# EAGLE design GW-RS485-V41-001 (EAGLE 7.6.0)
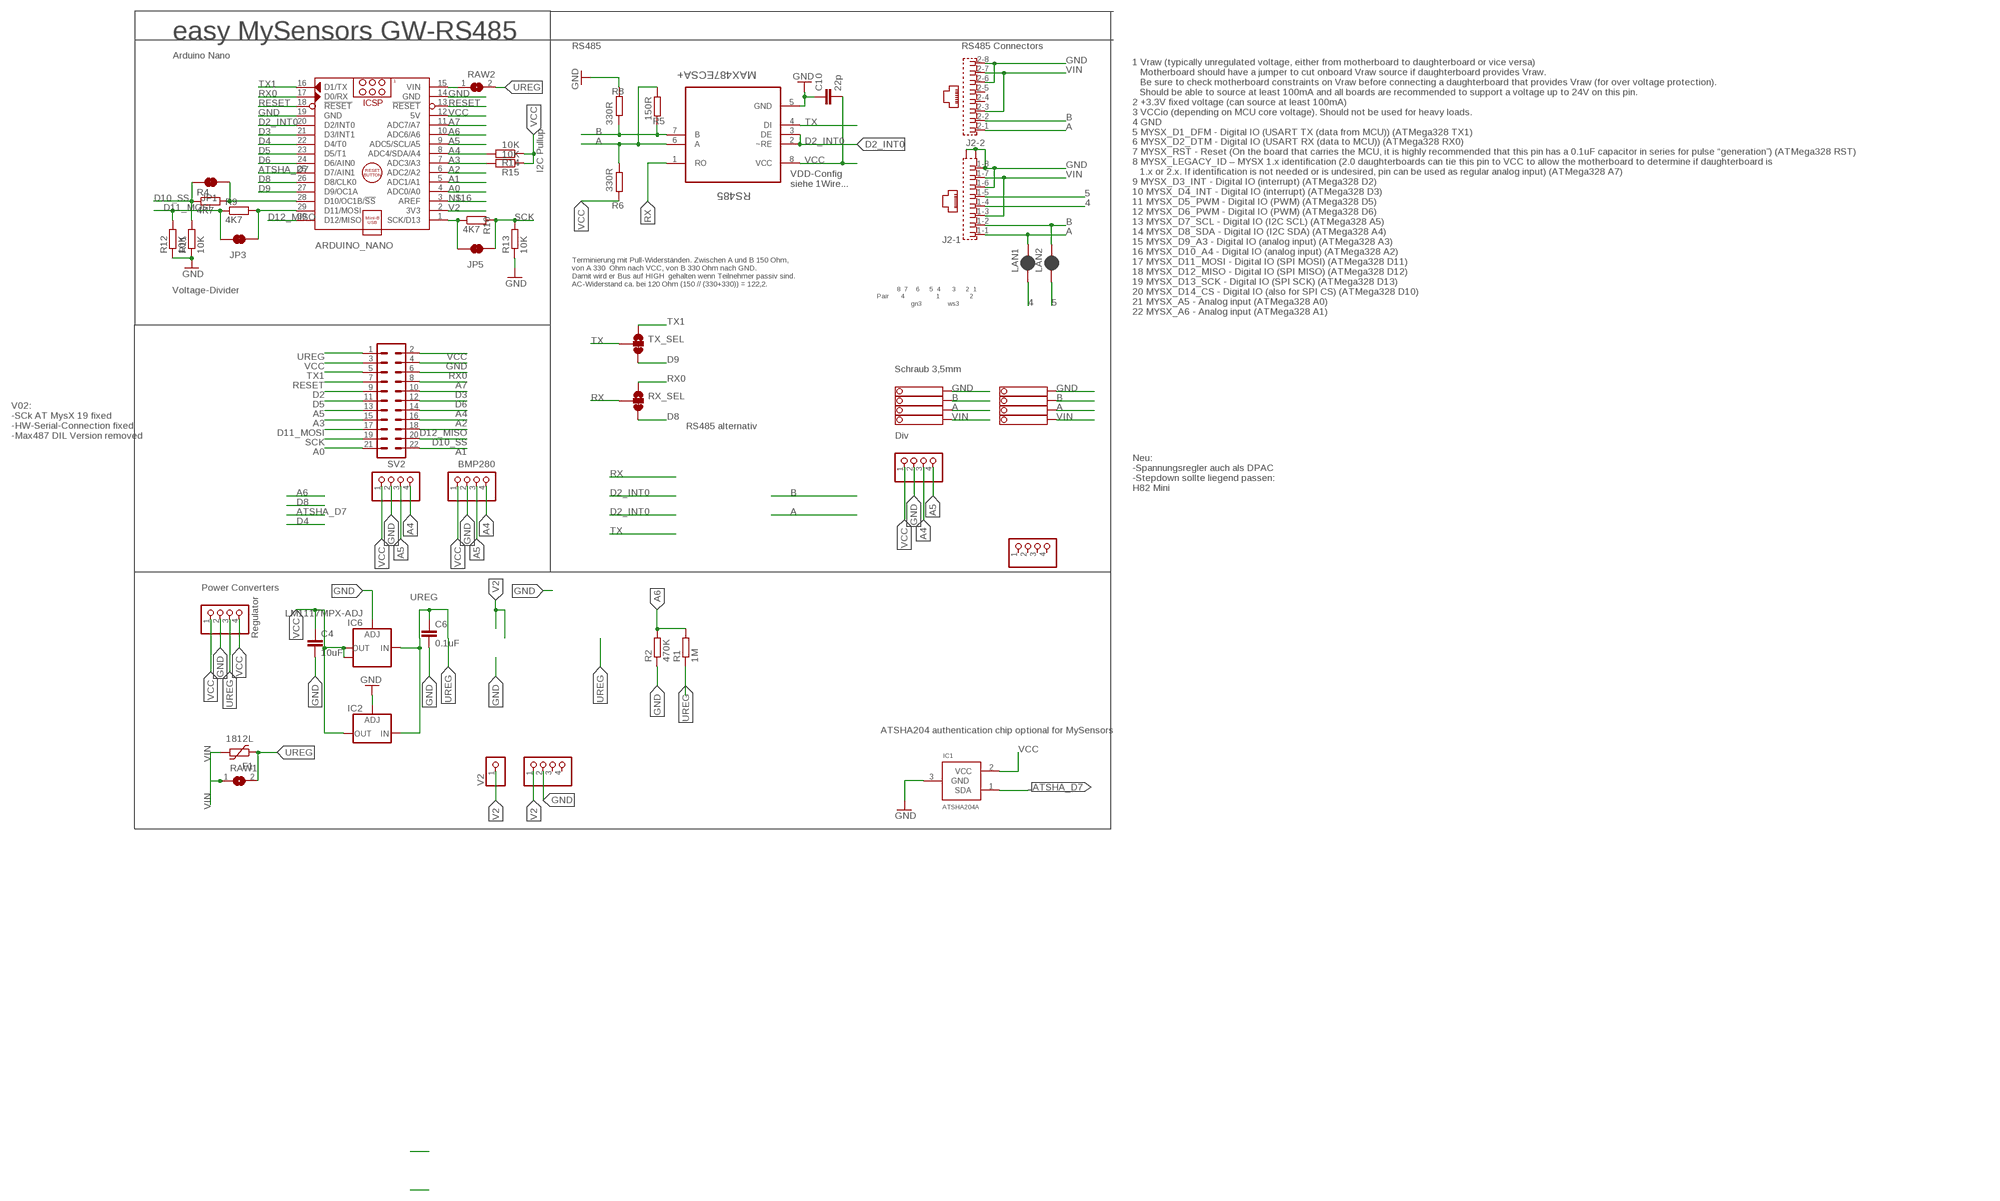
[diagram p0: schematic, sheet 1]

## Parts
ARDUINO_NANO  ARDUINO_NANO_OHNE-BOHR  [ARDUINO_NANO]
BH1750  PINHD-1X04_2.54-S  [1X04-S]
C4  10uF  C-EUC1210  [C1210]
C6  0.1uF  C-EUC1206  [C1206]
C10  22p  C-EUC0805  [C0805]
F1  1812L  [1812L]
I2C-1  PINHD-1X04_2.54-S  [1X04-S]
I2C-2  PINHD-1X04_2.54-S  [1X04-S]
IC1  ATSHA204A  [SOT23]
IC2  LD117ADT50TR  [DPACK]
IC6  LM1117MPX-ADJ  [SOT223]
J2  RJ45_2X_NARROW_SHILDPINS_NOCASE  [RJ45_2X_NARROW_SHILDPINS_NOCASE]
JP1  JUMPER-SMT_2_NC_TRACE_SILK  [SMT-JUMPER_2_NC_TRACE_SILK]
JP2  PINHD-1X04_2.54-S  [1X04-S]
JP3  JUMPER-SMT_2_NC_TRACE_SILK  [SMT-JUMPER_2_NC_TRACE_SILK]
JP5  JUMPER-SMT_2_NC_TRACE_SILK  [SMT-JUMPER_2_NC_TRACE_SILK]
LAN1  JUMPER-SMT_2_NC_PASTE_SILK  [SMT-JUMPER_2_NC_PASTE_SILK]
LAN2  JUMPER-SMT_2_NC_PASTE_SILK  [SMT-JUMPER_2_NC_PASTE_SILK]
R1  1M  R-EU_R0805  [R0805]
R2  470K  R-EU_R0805  [R0805]
R4  4K7  R-EU_M0805  [M0805]
R5  150R  R-EU_R0805  [R0805]
R6  330R  R-EU_R0805  [R0805]
R8  330R  R-EU_R0805  [R0805]
R9  4K7  R-EU_M0805  [M0805]
R10  4K7  R-EU_M0805  [M0805]
R11  10K  R-EU_M0805  [M0805]
R12  10K  R-EU_M0805  [M0805]
R13  10K  R-EU_M0805  [M0805]
R14  10K  R-EU_R0805  [R0805]
R15  10K  R-EU_R0805  [R0805]
RAW1  SJ  [SJ]
RAW2  SJ  [SJ]
RS485  MAX487ECSA+  [SOIC127P600X175-8N]
RX_SEL  JUMPER-SMT_3_1-NC_TRACE_SILK  [SMT-JUMPER_3_1-NC_TRACE_SILK]
STEPDWN  PINHD-1X04_2.54-S  [1X04-S]
SV2  MA11-2  [MA11-2]
TX_SEL  JUMPER-SMT_3_1-NC_TRACE_SILK  [SMT-JUMPER_3_1-NC_TRACE_SILK]
V2  PINHD-1X1  [1X01]
V2-  PINHD-1X04_2.54-S  [1X04-S]
X1  1751264  [1751264]
X4  1751264  [1751264]

## Nets
4: J2.1-4 LAN1.1
5: J2.1-5 LAN2.1
A: J2.1-1 J2.2-1 LAN1.2 R5.1 R6.2 RS485.6(A) X1.2 X4.2
A0: ARDUINO_NANO.4(ADC0/A0) SV2.21
A1: ARDUINO_NANO.5(ADC1/A1) SV2.22
A2: ARDUINO_NANO.6(ADC2/A2) SV2.16
A3: ARDUINO_NANO.7(ADC3/A3) R15.2 SV2.15
A4: ARDUINO_NANO.8(ADC4/SDA/A4) BH1750.4 I2C-1.4 I2C-2.3 R14.2 SV2.14
A5: ARDUINO_NANO.9(ADC5/SCL/A5) BH1750.3 I2C-1.3 I2C-2.4 SV2.13
A6: ARDUINO_NANO.10(ADC6/A6) R1.2 R2.2
A7: ARDUINO_NANO.11(ADC7/A7) SV2.8
ATSHA_D7: ARDUINO_NANO.25(D7/AIN1) IC1.1(SDA)
B: J2.1-2 J2.2-2 LAN2.2 R5.2 R8.1 RS485.7(B) X1.3 X4.3
D2: SV2.9
D2_INT0: ARDUINO_NANO.20(D2/INT0) RS485.2(~RE) RS485.3(DE)
D3: ARDUINO_NANO.21(D3/INT1) SV2.10
D4: ARDUINO_NANO.22(D4/T0)
D5: ARDUINO_NANO.23(D5/T1) SV2.11
D6: ARDUINO_NANO.24(D6/AIN0) SV2.12
D8: ARDUINO_NANO.26(D8/CLK0) RX_SEL.3
D9: ARDUINO_NANO.27(D9/OC1A) TX_SEL.3
D10_SS: JP1.1 R4.1 R11.2 SV2.20
D11_MOSI: JP3.1 R9.1 R12.2 SV2.17
D12_MISO: ARDUINO_NANO.30(D12/MISO) SV2.18
GND [Power]: ARDUINO_NANO.14(GND) ARDUINO_NANO.19(GND) BH1750.2 C4.2 C6.2 C10.1 I2C-1.2 I2C-2.2 IC1.3(GND) IC2.1(ADJ) IC6.1(ADJ) J2.1-6 J2.1-8 J2.2-6 J2.2-8 J2.G1(-1:S1) J2.G3(-1:S2) R2.1 R8.2 R11.1 R12.1 R13.1 RS485.5(GND) STEPDWN.2 SV2.4 V2-.2 X1.4 X4.4
N$5: ARDUINO_NANO.1(SCK/D13) JP5.1 R10.1
N$8: ARDUINO_NANO.28(D10/OC1B/!SS) JP1.2 R4.2
N$9: ARDUINO_NANO.29(D11/MOSI) JP3.2 R9.2
N$16: ARDUINO_NANO.3(AREF)
RAW1 [Power]: ARDUINO_NANO.15(VIN) RAW2.1
RESET: ARDUINO_NANO.13(!RESET) ARDUINO_NANO.18(!RESET) SV2.7
RX: RS485.1(RO) RX_SEL.2
RX0: ARDUINO_NANO.17(D0/RX) RX_SEL.1 SV2.6
SCK: JP5.2 R10.2 R13.2 SV2.19
TX: RS485.4(DI) TX_SEL.2
TX1: ARDUINO_NANO.16(D1/TX) SV2.5 TX_SEL.1
UREG [Power]: C6.1 F1.P$1 IC2.3(IN) IC6.3(IN) R1.1 RAW1.2 RAW2.2 STEPDWN.3 SV2.1
V2 [Power]: ARDUINO_NANO.2(3V3) V2-.1 V2.1
VCC [Power]: ARDUINO_NANO.12(5V) BH1750.1 C4.1 C10.2 I2C-1.1 I2C-2.1 IC1.2(VCC) IC2.4(OUT) IC6.2(OUT) IC6.TAB(OUT1) R6.1 R14.1 R15.1 RS485.8(VCC) STEPDWN.1 STEPDWN.4 SV2.2 SV2.3
VIN [Power]: F1.P$2 J2.1-3 J2.1-7 J2.2-3 J2.2-7 RAW1.1 X1.1 X4.1
Unconnected: J2.2-4 J2.2-5 JP2.1 JP2.2 JP2.3 JP2.4 V2-.3 V2-.4

## Notes on the sheet
- easy MySensors GW-RS485
- RS485 | RS485 Connectors
- Arduino Nano
- I2C Pullup
- VDD-Config
  siehe 1Wire...
- Voltage-Divider
- Terminierung mit Pull-Widerständen. Zwischen A und B 150 Ohm,
  von A 330  Ohm nach VCC, von B 330 Ohm nach GND. 
  Damit wird er Bus auf HIGH  gehalten wenn Teilnehmer passiv sind.
  AC-Widerstand ca. bei 120 Ohm (150 // (330+330)) = 122,2.
- 8  7    6     5  4      3     2  1
  Pair      4                1               2
                   gn3             ws3
- 1 Vraw (typically unregulated voltage, either from motherboard to daughterboard or vice versa)
     Motherboard should have a jumper to cut onboard Vraw source if daughterboard provides Vraw. 
     Be sure to check motherboard constraints on Vraw before connecting a daughterboard that provides Vraw (for over voltage protection). 
     Should be able to source at least 100mA and all boards are recommended to support a voltage up to 24V on this pin.
  2 +3.3V fixed voltage (can source at least 100mA)
  3 VCCio (depending on MCU core voltage). Should not be used for heavy loads.
  4 GND
  5 MYSX_D1_DFM - Digital IO (USART TX (data from MCU)) (ATMega328 TX1)
  6 MYSX_D2_DTM - Digital IO (USART RX (data to MCU)) (ATMega328 RX0)
  7 MYSX_RST - Reset (On the board that carries the MCU, it is highly recommended that this pin has a 0.1uF capacitor in series for pulse “generation”) (ATMega328 RST)
  8 MYSX_LEGACY_ID – MYSX 1.x identification (2.0 daughterboards can tie this pin to VCC to allow the motherboard to determine if daughterboard is 
     1.x or 2.x. If identification is not needed or is undesired, pin can be used as regular analog input) (ATMega328 A7)
  9 MYSX_D3_INT - Digital IO (interrupt) (ATMega328 D2)
  10 MYSX_D4_INT - Digital IO (interrupt) (ATMega328 D3)
  11 MYSX_D5_PWM - Digital IO (PWM) (ATMega328 D5)
  12 MYSX_D6_PWM - Digital IO (PWM) (ATMega328 D6)
  13 MYSX_D7_SCL - Digital IO (I2C SCL) (ATMega328 A5)
  14 MYSX_D8_SDA - Digital IO (I2C SDA) (ATMega328 A4)
  15 MYSX_D9_A3 - Digital IO (analog input) (ATMega328 A3)
  16 MYSX_D10_A4 - Digital IO (analog input) (ATMega328 A2)
  17 MYSX_D11_MOSI - Digital IO (SPI MOSI) (ATMega328 D11)
  18 MYSX_D12_MISO - Digital IO (SPI MISO) (ATMega328 D12)
  19 MYSX_D13_SCK - Digital IO (SPI SCK) (ATMega328 D13)
  20 MYSX_D14_CS - Digital IO (also for SPI CS) (ATMega328 D10)
  21 MYSX_A5 - Analog input (ATMega328 A0)
  22 MYSX_A6 - Analog input (ATMega328 A1)
- Schraub 3,5mm
- RS485 alternativ
- V02: 
  -SCk AT MysX 19 fixed
  -HW-Serial-Connection fixed
  -Max487 DIL Version removed
- Div
- BMP280
- Neu:
  -Spannungsregler auch als DPAC
  -Stepdown sollte liegend passen:  
  H82 Mini
- Power Converters
- Regulator
- ATSHA204 authentication chip optional for MySensors

## Library data of the parts
ARDUINO_NANO = ArduinoNanoV30:ARDUINO_NANO_OHNE-BOHR: Arduino Nano V3.0 Module Overview: The Arduino Nano is a small, complete, and breadboard-friendly board based on the ATmega328 (Arduino Nano 3.x) or ATmega168 (Arduino Nano 2.x). It has more or less the same functionality of the Arduino Duemilanove, but in a different package. It lacks only a DC power jack, and works with a Mini-B USB cable instead of a standard one. The Nano was designed and is being produced by Gravitech <http://www.gravitech.us/arna30wiatp.html>. General specifications: Item Value Microcontroller Atmel ATmega168 or ATmega328 Operating Voltage (logic level) 5 V Input Voltage (recommended) 7-12 V Input Voltage (limits) 6-20 V Digital I/O Pins 14 (of which 6 provide PWM output) Analog Input Pins 8 DC Current per I/O Pin 40 mA Flash Memory 16 KB (ATmega168) or 32 KB (ATmega328) of which 2 KB used by bootloader SRAM 1 KB (ATmega168) or 2 KB (ATmega328) EEPROM 512 bytes (ATmega168) or 1 KB (ATmega328) Clock Speed 16 MHz Dimensions (Inches) 0.73" x 1.70" Dimensions (mm) 18mm x 45mm Overall height About 9 mm (not including pins) Weigth 5 g Power: The Arduino Nano can be powered via the Mini-B USB connection, 6-20V unregulated external power supply (pin 30), or 5V regulated external power supply (pin 27). The power source is automatically selected to the highest voltage source. Memory: The ATmega168 has 16 KB of flash memory for storing code (of which 2 KB is used for the bootloader); the ATmega328 has 32 KB, (also with 2 KB used for the bootloader). The ATmega168 has 1 KB of SRAM and 512 bytes of EEPROM (which can be read and written with the EEPROM library); the ATmega328 has 2 KB of SRAM and 1 KB of EEPROM. Input and Output: Each of the 14 digital pins on the Nano can be used as an input or output, using pinMode(), digitalWrite(), and digitalRead() functions. They operate at 5 volts. Each pin can provide or receive a maximum of 40 mA and has an internal pull-up resistor (disconnected by default) of 20-50 kOhms. In addition, some pins have specialized functions. Visit Arduino - ArduinoBoardNano <https://www.arduino.cc/en/Main/ArduinoBoardNano>
BH1750 I2C-1 I2C-2 JP2 STEPDWN V2- = pinhead-2:PINHD-1X04: PIN HEADER
C4 C6 C10 = rcl:C-EU: CAPACITOR, European symbol
F1 = ptc-littlefuse:1812L
IC1 = Sensor:ATSHA204A
IC2 = v-reg:LD117A?*: Low drop fixed and adjustable positive voltage regulators 1 A Source: http://www.st.com/stonline/products/literature/ds/7194/ld1117axx.pdf
IC6 = lm1117:LM1117MPX-ADJ
J2 = RJ45:RJ45_2X_NARROW_SHILDPINS_NOCASE: RJ45 connector
JP1 JP3 JP5 = SparkFun-Jumpers:JUMPER-SMT_2_NC_TRACE: Normally closed trace jumper This jumper has a trace between two pads so it's normally closed (NC). Use a razor knife to open the connection. For best results follow the IPC guidelines for cutting traces: Cutout at least 0.063 mm (0.005 in). Remove all loose material to clean up the cut area. Seal the cut with an approved epoxy. Reapply solder to reclose the connection.
LAN1 LAN2 = SparkFun-Jumpers:JUMPER-SMT_2_NC_PASTE: Normally closed solder jumper This jumper has an aperture in the stencil to allow solder paste to bridge the split in the wire so it's normally closed (NC). Wick off the solder to open the connection. Reapply solder to reclose the connection.
R1 R2 R4-R6 R8-R15 = rcl:R-EU_: RESISTOR, European symbol
RAW1 RAW2 = jumper:SJ: SMD solder JUMPER
RS485 = Maxim_By_element14_Batch_1:MAX487ECSA+: Low-Power, Slew-Rate-Limited RS-485/RS-422 Transceivers; MPN: MAX487ECSA+; OC_FARNELL: 9724532; OC_NEWARK: 68K4803; PACKAGE: SOIC-8; SUPPLIER: Maxim
RX_SEL TX_SEL = SparkFun-Jumpers:JUMPER-SMT_3_1-NC_TRACE: Normally closed trace jumper (1 of 2 connections) This jumper has a trace between two pads so it's normally closed (NC). The other connection is normally open (NO). Use a razor knife to open the connection. For best results follow the IPC guidelines for cutting traces: Cutout at least 0.063 mm (0.005 in). Remove all loose material to clean up the cut area. Seal the cut with an approved epoxy. Reapply solder to reclose the connection, or to close the NO connection.
SV2 = con-Pinheader:MA11-2: PIN HEADER; OC_FARNELL: unknown; OC_NEWARK: unknown
V2 = pinhead:PINHD-1X1: PIN HEADER
X1 X4 = con-phoenix-350:1751264: MKDS 1/ 4-3,5 Printklemme Nennstrom: 10 A Bemessungsspannung: 160 V Raster: 3,5 mm Polzahl: 4 Montageart: Löten Anschlussart: Schraubanschluss Anschlussrichtung vom Leiter zur Platine: 0° Source: http://eshop.phoenixcontact.com .. 1751264.pdf; MPN: 1751264; OC_FARNELL: unknown; OC_NEWARK: 10R0934

## Net classes
0 default: width 0.305 mm
1 Power: width 0.508 mm

## Board
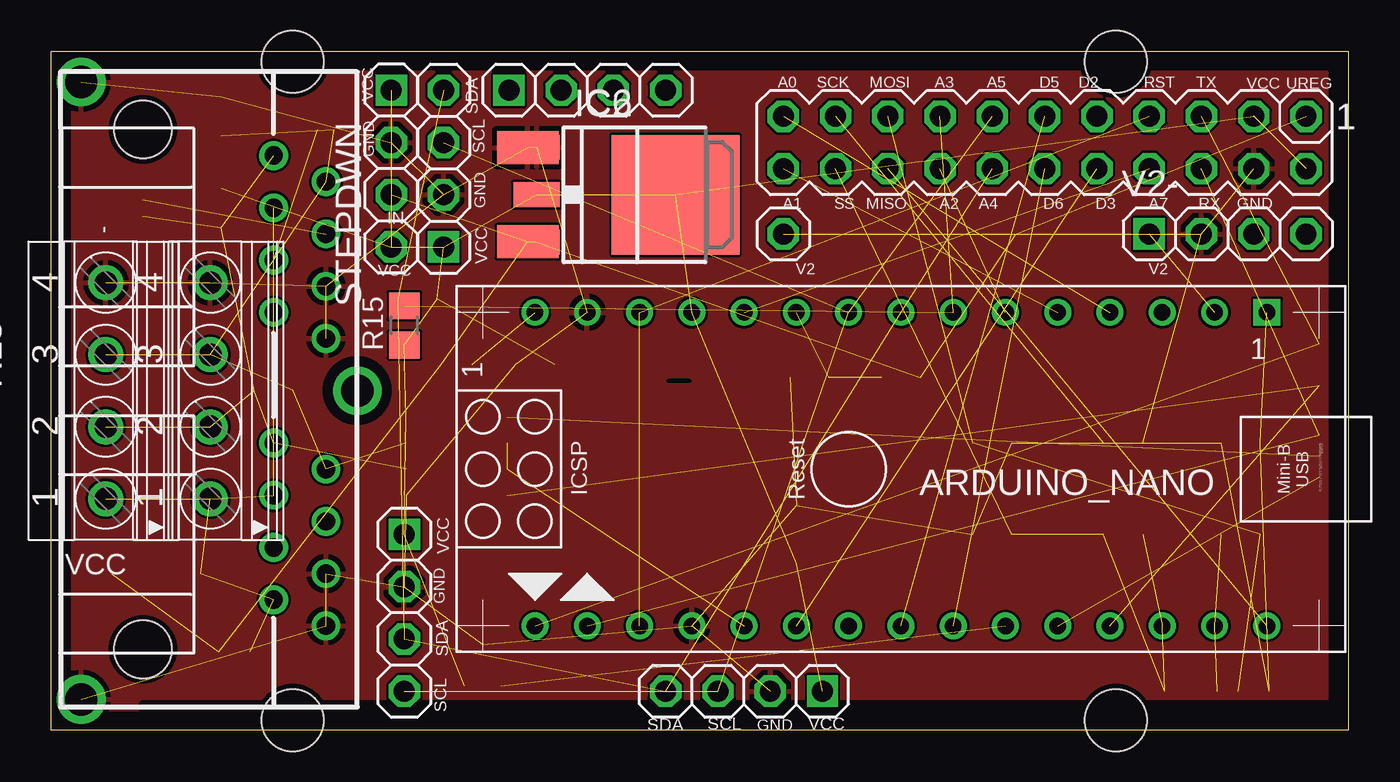
[diagram p1: board, top side]
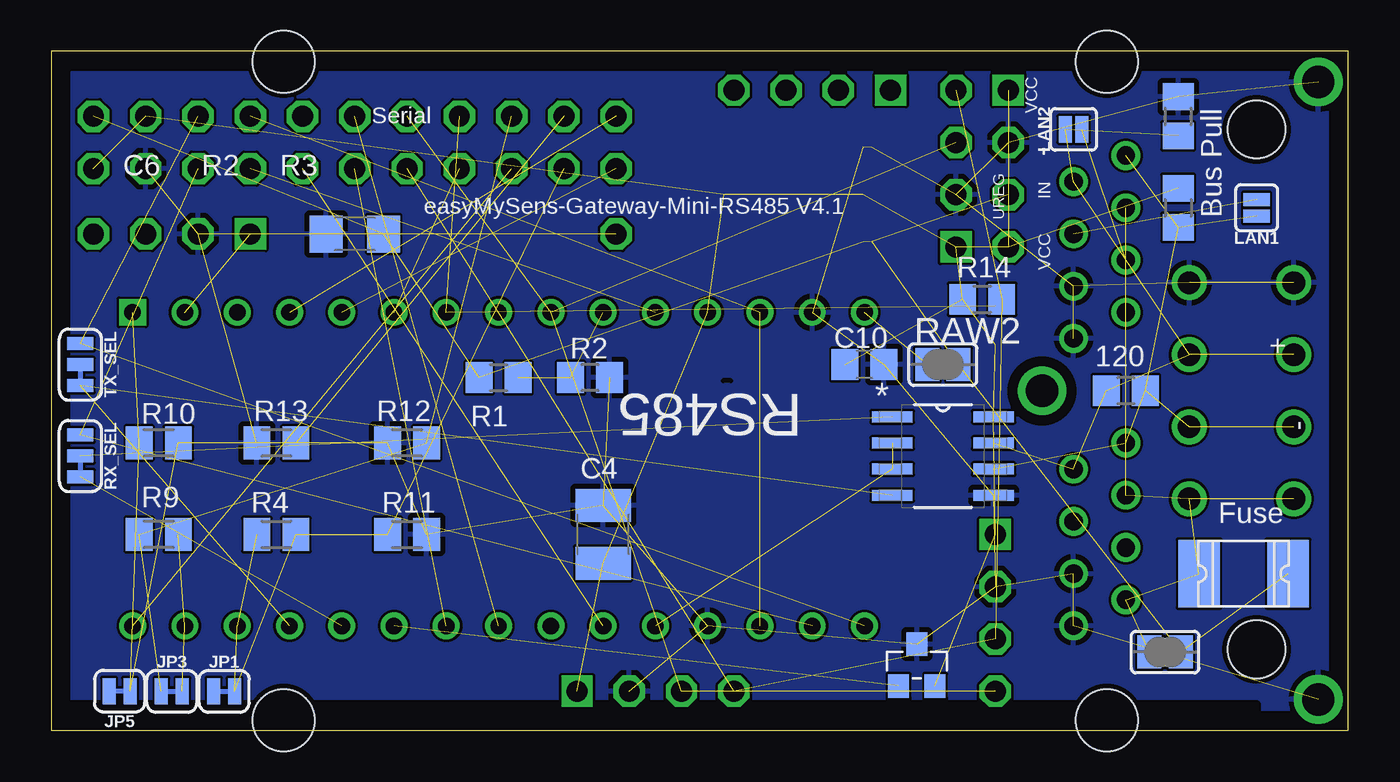
[diagram p2: board, bottom side, seen from below]

Size 63 x 33 mm. Coordinates in mm from the lower left corner, seen from the top.
Outline: 63,0 0,0 0,33 63,33 63,0
Copper layers (1*16): Top 0.035mm / dielectric 1.5mm / Bottom 0.035mm
Design rules "dirt_cheap_dirty_boards.v1": minimum track width 5mil, minimum drill 12mil, track to track 5mil, track to pad 5mil, pad to pad 5mil, via to via 5mil, smd to smd 0mil, copper to edge 10mil, drill to drill 10mil, minimum pad ring 10mil, minimum via ring 6mil, stop-mask expansion 2mil, vias tented up to drill 25mil, thermal gap 10mil
Holes 3 mm at 11.72,32.5 11.72,0.5 51.72,32.5 51.72,0.5
tRestrict: area 3.8,32.4 to 62.9,33; area 4.4,0 to 62.9,1.3; area 13.3,14.9 to 16.5,18.1; 1 lines
bRestrict: area 3.8,32.4 to 62.9,33; area 4.4,0 to 62.9,1.3; area 13.3,14.9 to 16.5,18.1; 1 lines

### Footprints (pad centres in the part's own frame; a part is rotated, then mirrored left to right if it is on the bottom)
ARDUINO_NANO = drill 0.8 square: 1 -20.32,-7.62 | drill 0.8: 2 -17.78,-7.62; 3 -15.24,-7.62; 4 -12.7,-7.62; 5 -10.16,-7.62; 6 -7.62,-7.62; 7 -5.08,-7.62; 8 -2.54,-7.62; 9 0,-7.62; 10 2.54,-7.62; 11 5.08,-7.62; 12 7.62,-7.62; 13 10.16,-7.62; 14 12.7,-7.62; 15 15.24,-7.62; 16 15.24,7.62; 17 12.7,7.62; 18 10.16,7.62; 19 7.62,7.62; 20 5.08,7.62; 21 2.54,7.62; 22 0,7.62; 23 -2.54,7.62; 24 -5.08,7.62; 25 -7.62,7.62; 26 -10.16,7.62; 27 -12.7,7.62; 28 -15.24,7.62; 29 -17.78,7.62; 30 -20.32,7.62
1X04-S = drill 1.016 square: 1 -3.81,0 | drill 1.016 octagon: 2 -1.27,0; 3 1.27,0; 4 3.81,0
C1210 = smd 1.6 x 2.7: 1 -1.4,0; 2 1.4,0
C1206 = smd 1.6 x 1.8: 1 -1.4,0; 2 1.4,0
C0805 = smd 1.3 x 1.5: 1 -0.95,0; 2 0.95,0
1812L = smd 2.03 x 3.3: P$1 -2.16,0; P$2 2.16,0
SOT23 = smd 1.016 x 1.143: 1 -0.889,-1.016; 2 0.889,-1.016; 3 0,1.016
DPACK = smd 1.6 x 3: 1 -2.28,-4.8; 3 2.28,-4.8 | smd 5.8 x 6.2: 4 0,2.38
SOT223 = smd 1.219 x 2.235: 1 -2.311,-3.099; 2 0,-3.099; 3 2.311,-3.099 | smd 3.6 x 2.2: TAB 0,3.099
RJ45_2X_NARROW_SHILDPINS_NOCASE = drill 0.889: 1-1 -11.43,6.35; 1-2 -10.16,8.89; 1-3 -8.89,6.35; 1-4 -7.62,8.89; 1-5 -6.35,6.35; 1-6 -5.08,8.89; 1-7 -3.81,6.35; 1-8 -2.54,8.89; 2-1 2.54,6.35; 2-2 3.81,8.89; 2-3 5.08,6.35; 2-4 6.35,8.89; 2-5 7.62,6.35; 2-6 8.89,8.89; 2-7 10.16,6.35; 2-8 11.43,8.89 | drill 1.575 pad 2.184: G1 -15,-3; G2 0,10.414; G3 15,-3 | hole 2.8: -12.7,0; 12.573,0
SMT-JUMPER_2_NC_TRACE_SILK = smd 0.635 x 1.27: 1 -0.508,0; 2 0.508,0
SMT-JUMPER_2_NC_PASTE_SILK = smd 0.635 x 1.27: 1 -0.406,0; 2 0.406,0
R0805 = smd 1.3 x 1.5: 1 -0.95,0; 2 0.95,0
M0805 = smd 1.3 x 1.6: 1 -0.95,0; 2 0.95,0
SJ = smd 1.168 x 1.6: 1 -0.762,0; 2 0.762,0
SOIC127P600X175-8N = smd 1.981 x 0.533: 1 -2.464,1.905; 2 -2.464,0.635; 3 -2.464,-0.635; 4 -2.464,-1.905; 5 2.464,-1.905; 6 2.464,-0.635; 7 2.464,0.635; 8 2.464,1.905
SMT-JUMPER_3_1-NC_TRACE_SILK = smd 0.635 x 1.27: 1 -1.016,0; 2 0,0; 3 1.016,0
MA11-2 = drill 1.016 octagon: 1 -12.7,-1.27; 2 -12.7,1.27; 3 -10.16,-1.27; 4 -10.16,1.27; 5 -7.62,-1.27; 6 -7.62,1.27; 7 -5.08,-1.27; 8 -5.08,1.27; 9 -2.54,-1.27; 10 -2.54,1.27; 11 0,-1.27; 12 0,1.27; 13 2.54,-1.27; 14 2.54,1.27; 15 5.08,-1.27; 16 5.08,1.27; 17 7.62,-1.27; 18 7.62,1.27; 19 10.16,-1.27; 20 10.16,1.27; 21 12.7,-1.27; 22 12.7,1.27
1X01 = drill 1.016 octagon: 1 0,0
1751264 = drill 1.1 pad 1.7: 1 -5.25,-0.1; 2 -1.75,-0.1; 3 1.75,-0.1; 4 5.25,-0.1

### Placement (x,y rotation side)
ARDUINO_NANO  38.73,12.7 180 top
BH1750  19.05,27.3 90 top
C4  36.2,9.53 90 bottom
C6  48.26,24.13 180 bottom
C10  23.5,17.78 180 bottom
F1  5.08,7.62 180 bottom
I2C-1  33.66,1.91 180 top
I2C-2  17.14,5.71 270 top
IC1  20.95,3.17 0 bottom
IC2  27.94,26.04 270 top
IC6  26.67,26.04 270 top
J2  4.45,16.51 270 top
JP1  54.61,1.91 0 bottom
JP2  26.04,31.11 0 top
JP3  57.15,1.91 0 bottom
JP5  59.69,1.91 180 bottom
LAN1  4.45,25.4 270 bottom
LAN2  13.34,29.21 180 bottom
R1  41.27,17.14 0 bottom
R2  36.83,17.14 180 bottom
R4  52.07,9.53 180 bottom
R5  10.79,16.51 180 bottom
R6  8.26,25.4 270 bottom
R8  8.26,29.84 90 bottom
R9  57.78,9.53 0 bottom
R10  57.78,13.97 0 bottom
R11  45.72,9.53 180 bottom
R12  45.72,13.97 0 bottom
R13  52.07,13.97 0 bottom
R14  17.78,20.95 0 bottom
R15  17.14,19.68 90 top
RAW1  8.89,3.81 0 bottom
RAW2  19.68,17.78 0 bottom
RS485  19.68,13.34 0 bottom
RX_SEL  61.59,13.34 270 bottom
STEPDWN  16.51,27.3 270 top
SV2  48.26,28.57 180 top
TX_SEL  61.59,17.78 270 bottom
V2  35.56,24.13 0 top
V2-  57.15,24.13 0 top
X1  2.54,16.51 90 top
X4  7.62,16.51 90 top

### Tracks (layer width: path | path; a pad name or v marks a point on that pad's centre or on a via)
4  (1 unrouted)
5  (1 unrouted)
A  (7 unrouted)
A0  (1 unrouted)
A1  (1 unrouted)
A2  (1 unrouted)
A3  (2 unrouted)
A4  (5 unrouted)
A5  (4 unrouted)
A6  (2 unrouted)
A7  (1 unrouted)
ATSHA_D7  (1 unrouted)
B  (7 unrouted)
D2_INT0  (2 unrouted)
D3  (1 unrouted)
D5  (1 unrouted)
D6  (1 unrouted)
D8  (1 unrouted)
D9  (1 unrouted)
D10_SS  (3 unrouted)
D11_MOSI  (3 unrouted)
D12_MISO  (1 unrouted)
GND  (27 unrouted)
  pour Bottom: 1,32 1,1 62,1 62,32
  pour Top: 1,1 62,1 62,32 1,32
N$5  (2 unrouted)
N$8  (2 unrouted)
N$9  (2 unrouted)
RAW1  (1 unrouted)
RESET  (2 unrouted)
RX  (1 unrouted)
RX0  (2 unrouted)
SCK  (3 unrouted)
TX  (1 unrouted)
TX1  (2 unrouted)
UREG  (8 unrouted)
V2  (2 unrouted)
VCC  (17 unrouted)
VIN  (7 unrouted)

### Text on the board
tPlace: VCC | UREG | VCC | A0 | SCK | MOSI | A3 | A5 | D5 | D2 | RST | TX | GND | A1 | SS | MISO | A2 | A4 | D6 | D3 | A7 | RX | GND | GND | V2 | V2 | VCC | R15 | GND | GND
bPlace: UREG | easyMySens-Gateway-Mini-RS485 V4.1
tNames: SDA | SCL | IN | - | VCC | VCC | VCC | SDA | SCL | SDA | SCL | VCC
bNames: VCC | Serial | - | IN | R3 | R2 | C6 | Bus Pull | VCC | R14 | + | C10 | 120 | R2 | - | R1 | R12 | R13 | R10 | C4 | R11 | R4 | R9 | Fuse
tValues: Gehäuse: RND 455‑00307